# EAGLE design driver_3 (EAGLE 7.2.0)
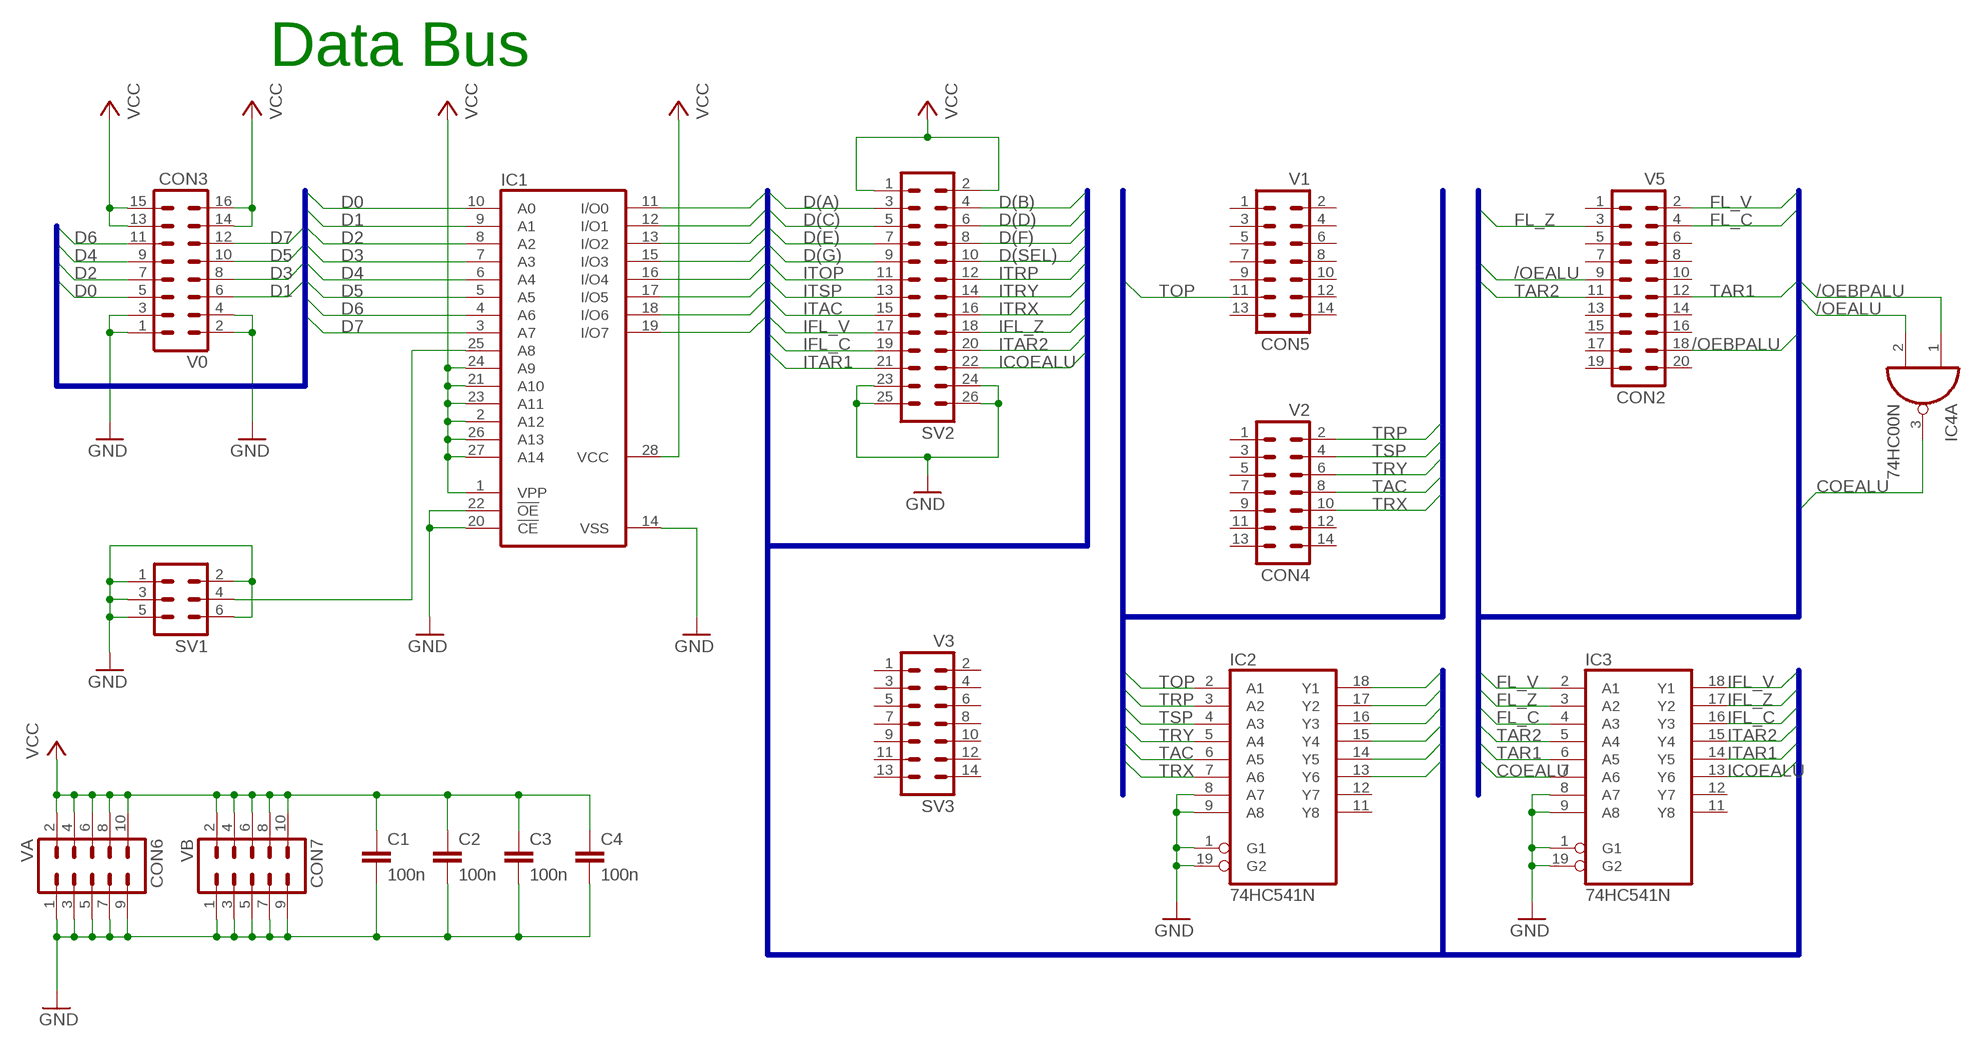
[diagram p0: schematic, sheet 1]

## Parts
C1  100n  C-EU050-024X044  [C050-024X044]
C2  100n  C-EU050-024X044  [C050-024X044]
C3  100n  C-EU050-024X044  [C050-024X044]
C4  100n  C-EU050-024X044  [C050-024X044]
CON2  V5  ML20  [ML20]
CON3  V0  ML16  [ML16]
CON4  V2  ML14  [ML14]
CON5  V1  ML14  [ML14]
CON6  VA  ML10  [ML10]
CON7  VB  ML10  [ML10]
IC1  27C256AG  [DIL28-6]
IC2  74HC541N  [DIL20]
IC3  74HC541N  [DIL20]
IC4  74HC00N  [DIL14]
SV1  ML6  [ML6]
SV2  ML26L  [ML26L]
SV3  V3  ML14  [ML14]

## Nets
/OEALU: CON2.9 IC4.2(A:I1)
/OEBPALU: CON2.18 IC4.1(A:I0)
COEALU: IC3.7(A6) IC4.3(A:O)
D0: CON3.5 IC1.10(A0)
D1: CON3.6 IC1.9(A1)
D2: CON3.7 IC1.8(A2)
D3: CON3.8 IC1.7(A3)
D4: CON3.9 IC1.6(A4)
D5: CON3.10 IC1.5(A5)
D6: CON3.11 IC1.4(A6)
D7: CON3.12 IC1.3(A7)
D(A): IC1.11(I/O0) SV2.3
D(B): IC1.12(I/O1) SV2.4
D(C): IC1.13(I/O2) SV2.5
D(D): IC1.15(I/O3) SV2.6
D(E): IC1.16(I/O4) SV2.7
D(F): IC1.17(I/O5) SV2.8
D(G): IC1.18(I/O6) SV2.9
D(SEL): IC1.19(I/O7) SV2.10
FL_C: CON2.4 IC3.4(A3)
FL_V: CON2.2 IC3.2(A1)
FL_Z: CON2.3 IC3.3(A2)
GND: C1.2 C2.2 C3.2 C4.2 CON3.1 CON3.2 CON3.3 CON3.4 CON6.1 CON6.3 CON6.5 CON6.7 CON6.9 CON7.1 CON7.3 CON7.5 CON7.7 CON7.9 IC1.14(VSS) IC1.20(!CE) IC1.22(!OE) IC2.1(G1) IC2.8(A7) IC2.9(A8) IC2.19(G2) IC3.1(G1) IC3.8(A7) IC3.9(A8) IC3.19(G2) SV1.1 SV1.2 SV1.3 SV1.5 SV1.6 SV2.23 SV2.24 SV2.25 SV2.26
ICOEALU: IC3.13(Y6) SV2.22
IFL_C: IC3.16(Y3) SV2.19
IFL_V: IC3.18(Y1) SV2.17
IFL_Z: IC3.17(Y2) SV2.18
ITAC: IC2.14(Y5) SV2.15
ITAR1: IC3.14(Y5) SV2.21
ITAR2: IC3.15(Y4) SV2.20
ITOP: IC2.18(Y1) SV2.11
ITRP: IC2.17(Y2) SV2.12
ITRX: IC2.13(Y6) SV2.16
ITRY: IC2.15(Y4) SV2.14
ITSP: IC2.16(Y3) SV2.13
N$2: IC1.25(A8) SV1.4
TAC: CON4.8 IC2.6(A5)
TAR1: CON2.12 IC3.6(A5)
TAR2: CON2.11 IC3.5(A4)
TOP: CON5.11 IC2.2(A1)
TRP: CON4.2 IC2.3(A2)
TRX: CON4.10 IC2.7(A6)
TRY: CON4.6 IC2.5(A4)
TSP: CON4.4 IC2.4(A3)
VCC: C1.1 C2.1 C3.1 C4.1 CON3.13 CON3.14 CON3.15 CON3.16 CON6.2 CON6.4 CON6.6 CON6.8 CON6.10 CON7.2 CON7.4 CON7.6 CON7.8 CON7.10 IC1.1(VPP) IC1.2(A12) IC1.21(A10) IC1.23(A11) IC1.24(A9) IC1.26(A13) IC1.27(A14) IC1.28(VCC) SV2.1 SV2.2
Unconnected: CON2.1 CON2.5 CON2.6 CON2.7 CON2.8 CON2.10 CON2.13 CON2.14 CON2.15 CON2.16 CON2.17 CON2.19 CON2.20 CON4.1 CON4.3 CON4.5 CON4.7 CON4.9 CON4.11 CON4.12 CON4.13 CON4.14 CON5.1 CON5.2 CON5.3 CON5.4 CON5.5 CON5.6 CON5.7 CON5.8 CON5.9 CON5.10 CON5.12 CON5.13 CON5.14 IC2.11(Y8) IC2.12(Y7) IC3.11(Y8) IC3.12(Y7) IC4.4(B:I0) IC4.5(B:I1) IC4.6(B:O) IC4.8(C:O) IC4.9(C:I0) IC4.10(C:I1) IC4.11(D:O) IC4.12(D:I0) IC4.13(D:I1) SV3.1 SV3.2 SV3.3 SV3.4 SV3.5 SV3.6 SV3.7 SV3.8 SV3.9 SV3.10 SV3.11 SV3.12 SV3.13 SV3.14

## Buses
D[0..7]
D(A),D(B),D(C),D(D),D(E),D(F),D(G),D(SEL),ITOP,ITRP,ITSP,ITRY,ITAC,ITRX,IFL_V,IFL_Z,IFL_C,ITAR1,ITAR2,ICOEALU
TAR1,TAR2,/OEALU,/OEBPALU,COEALU,FL_C,FL_Z,FL_V
TAC,TRX,TRY,TSP,TRP,TOP

## Notes on the sheet
- Data Bus

## Power pins joined to a net without a drawn wire
GND: IC2.10(GND) IC3.10(GND) IC4.7(P:GND)
VCC: IC2.20(VCC) IC3.20(VCC) IC4.14(P:VCC)

## Library data of the parts
C1-C4 = rcl:C-EU: CAPACITOR, European symbol
CON2 = con-ml:ML20: HARTING; OC_FARNELL: unknown; OC_NEWARK: unknown
CON3 = con-ml:ML16: HARTING; OC_FARNELL: unknown; OC_NEWARK: unknown
CON4 CON5 SV3 = con-ml:ML14: HARTING; OC_FARNELL: unknown; OC_NEWARK: unknown
CON6 CON7 = con-ml:ML10: HARTING; OC_FARNELL: unknown; OC_NEWARK: unknown
IC1 = memory-hitachi:27C256AG: MEMORY; OC_FARNELL: unknown; OC_NEWARK: unknown
IC2 IC3 = 74xx-eu:74*541: Octal BUFFER and LINE DRIVER, 3-state
IC4 = 74xx-eu:74*00: Quad 2-input NAND gate
SV1 = con-ml:ML6: HARTING; OC_FARNELL: unknown; OC_NEWARK: unknown
SV2 = con-ml:ML26L: HARTING; OC_FARNELL: unknown; OC_NEWARK: unknown

## Board
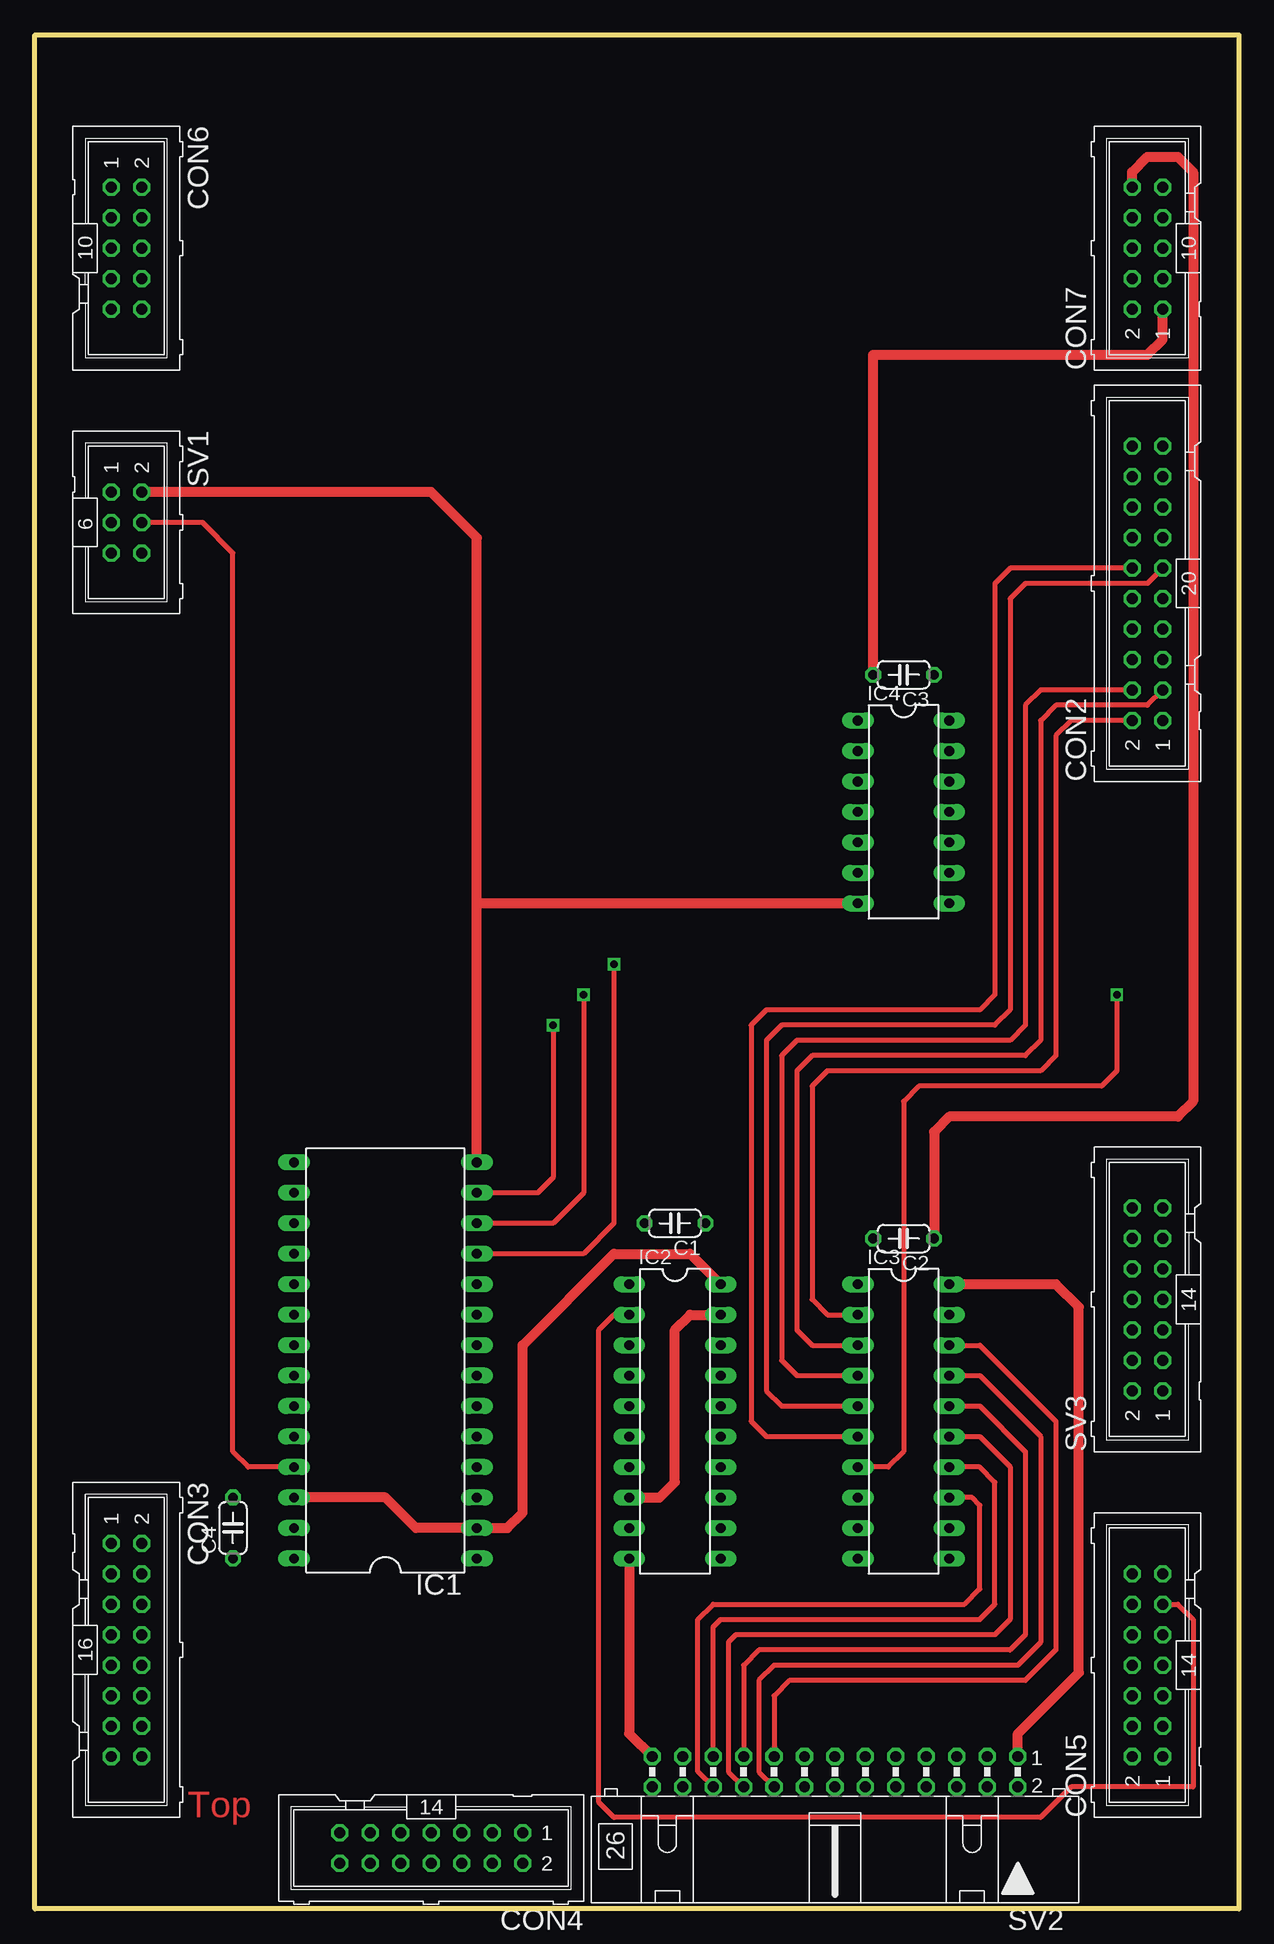
[diagram p1: board, top side]
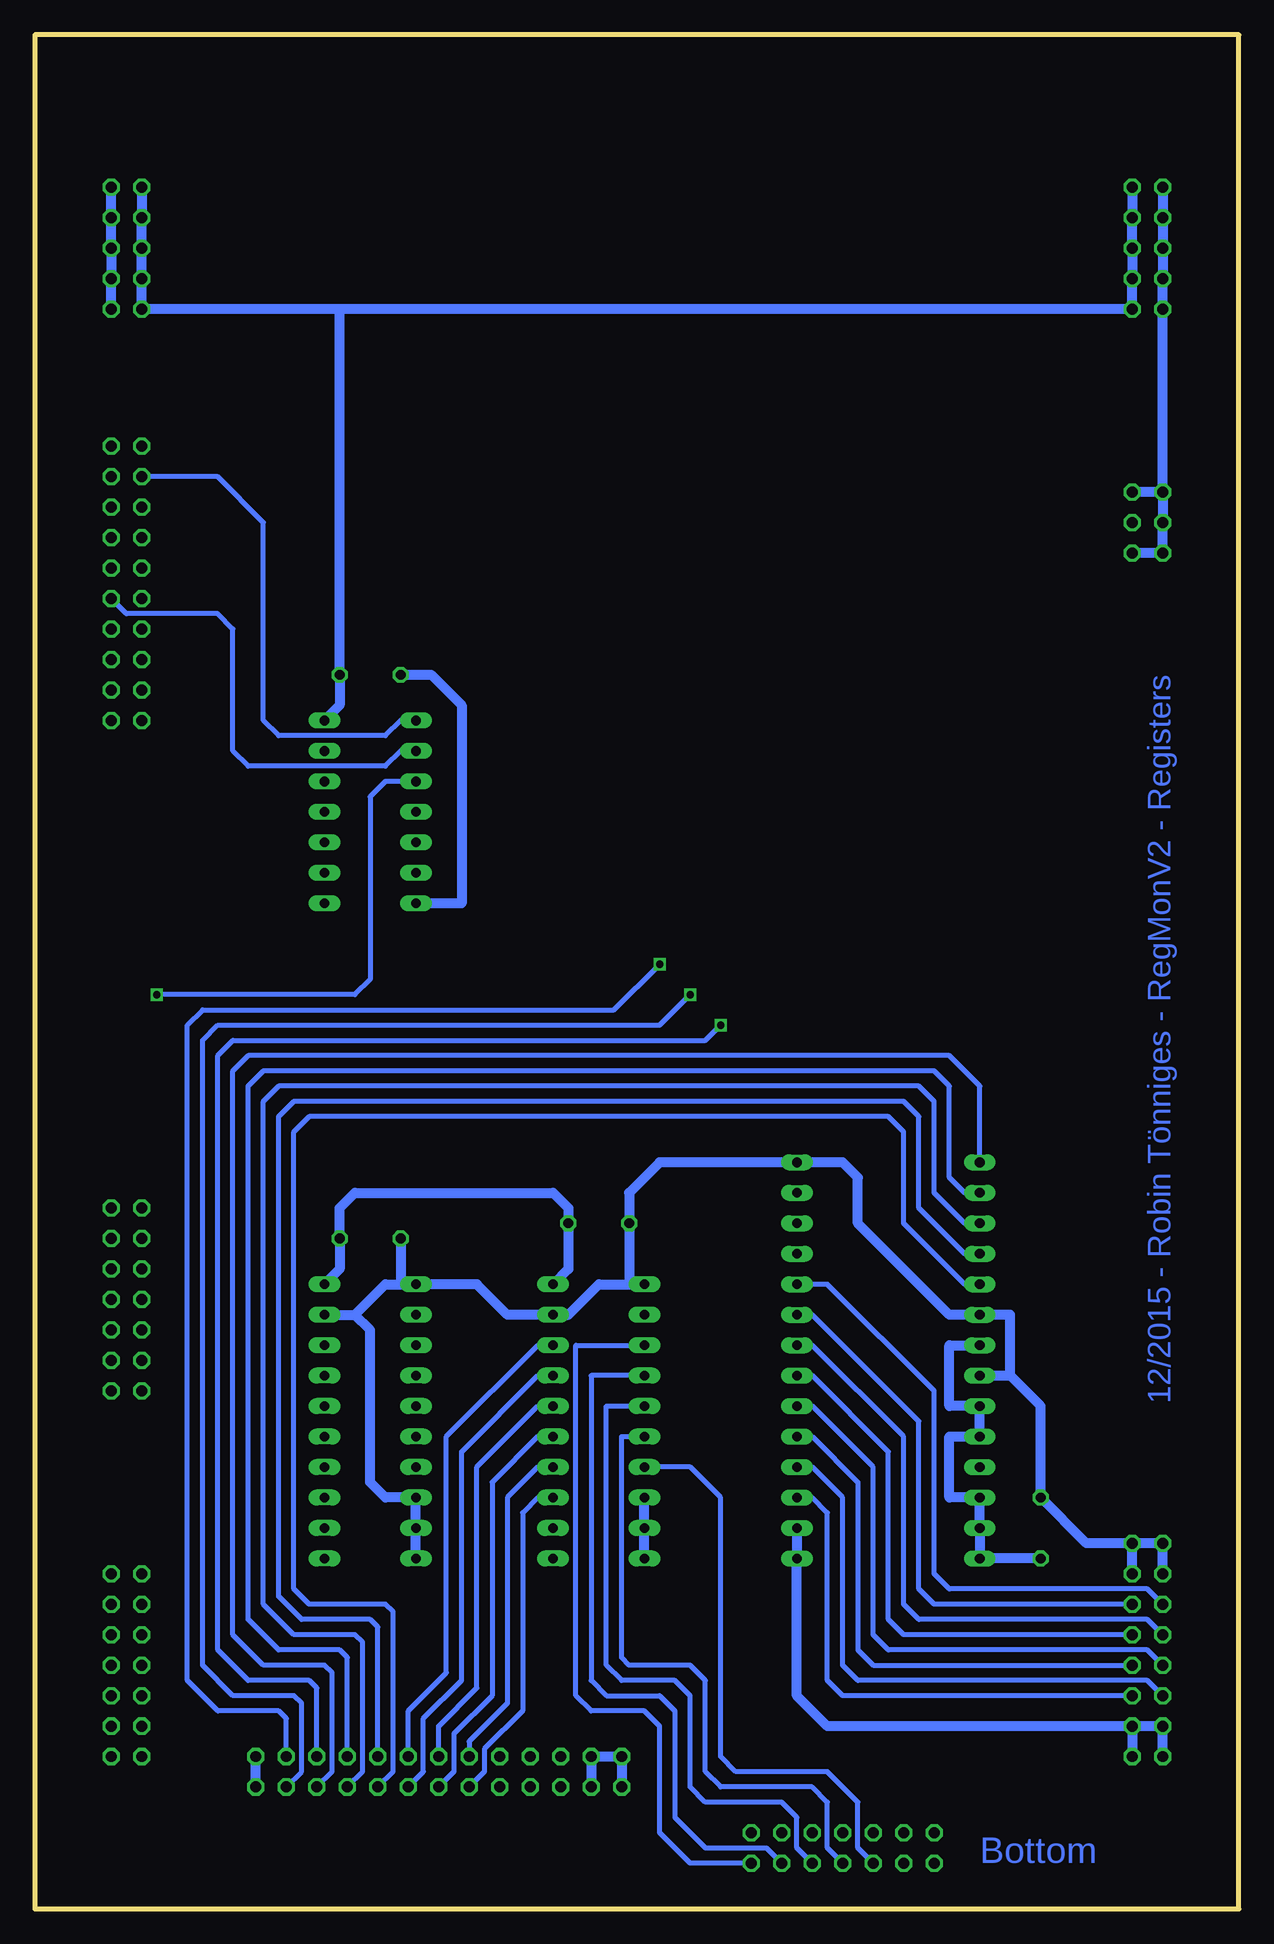
[diagram p2: board, bottom side, seen from below]

Size 100.33 x 156.21 mm. Coordinates in mm from the lower left corner, seen from the top.
Outline: 0,0 0,156.21 100.33,156.21 100.33,0 0,0
Copper layers (1*16): Top 0.035mm / dielectric 1.5mm / Bottom 0.035mm
Design rules "default": minimum track width 10mil, minimum drill 24mil, track to track 10mil, track to pad 20mil, pad to pad 8mil, via to via 8mil, smd to smd 8mil, copper to edge 40mil, drill to drill 8mil, minimum pad ring 10mil, minimum via ring 8mil, stop-mask expansion 4mil, vias tented up to drill 0mil, thermal gap 10mil

### Footprints (pad centres in the part's own frame; a part is rotated, then mirrored left to right if it is on the bottom)
C050-024X044 = drill 0.813 octagon: 1 -2.54,0; 2 2.54,0
ML20 = drill 0.914 octagon: 1 -11.43,-1.27; 2 -11.43,1.27; 3 -8.89,-1.27; 4 -8.89,1.27; 5 -6.35,-1.27; 6 -6.35,1.27; 7 -3.81,-1.27; 8 -3.81,1.27; 9 -1.27,-1.27; 10 -1.27,1.27; 11 1.27,-1.27; 12 1.27,1.27; 13 3.81,-1.27; 14 3.81,1.27; 15 6.35,-1.27; 16 6.35,1.27; 17 8.89,-1.27; 18 8.89,1.27; 19 11.43,-1.27; 20 11.43,1.27
ML16 = drill 0.914 octagon: 1 -8.89,-1.27; 2 -8.89,1.27; 3 -6.35,-1.27; 4 -6.35,1.27; 5 -3.81,-1.27; 6 -3.81,1.27; 7 -1.27,-1.27; 8 -1.27,1.27; 9 1.27,-1.27; 10 1.27,1.27; 11 3.81,-1.27; 12 3.81,1.27; 13 6.35,-1.27; 14 6.35,1.27; 15 8.89,-1.27; 16 8.89,1.27
ML14 = drill 0.914 octagon: 1 -7.62,-1.27; 2 -7.62,1.27; 3 -5.08,-1.27; 4 -5.08,1.27; 5 -2.54,-1.27; 6 -2.54,1.27; 7 0,-1.27; 8 0,1.27; 9 2.54,-1.27; 10 2.54,1.27; 11 5.08,-1.27; 12 5.08,1.27; 13 7.62,-1.27; 14 7.62,1.27
ML10 = drill 0.914 octagon: 1 -5.08,-1.27; 2 -5.08,1.27; 3 -2.54,-1.27; 4 -2.54,1.27; 5 0,-1.27; 6 0,1.27; 7 2.54,-1.27; 8 2.54,1.27; 9 5.08,-1.27; 10 5.08,1.27
DIL28-6 = drill 0.813 long: 1 -16.51,-7.62; 2 -13.97,-7.62; 3 -11.43,-7.62; 4 -8.89,-7.62; 5 -6.35,-7.62; 6 -3.81,-7.62; 7 -1.27,-7.62; 8 1.27,-7.62; 9 3.81,-7.62; 10 6.35,-7.62; 11 8.89,-7.62; 12 11.43,-7.62; 13 13.97,-7.62; 14 16.51,-7.62; 15 16.51,7.62; 16 13.97,7.62; 17 11.43,7.62; 18 8.89,7.62; 19 6.35,7.62; 20 3.81,7.62; 21 1.27,7.62; 22 -1.27,7.62; 23 -3.81,7.62; 24 -6.35,7.62; 25 -8.89,7.62; 26 -11.43,7.62; 27 -13.97,7.62; 28 -16.51,7.62
DIL20 = drill 0.813 long: 1 -11.43,-3.81; 2 -8.89,-3.81; 3 -6.35,-3.81; 4 -3.81,-3.81; 5 -1.27,-3.81; 6 1.27,-3.81; 7 3.81,-3.81; 8 6.35,-3.81; 9 8.89,-3.81; 10 11.43,-3.81; 11 11.43,3.81; 12 8.89,3.81; 13 6.35,3.81; 14 3.81,3.81; 15 1.27,3.81; 16 -1.27,3.81; 17 -3.81,3.81; 18 -6.35,3.81; 19 -8.89,3.81; 20 -11.43,3.81
DIL14 = drill 0.813 long: 1 -7.62,-3.81; 2 -5.08,-3.81; 3 -2.54,-3.81; 4 0,-3.81; 5 2.54,-3.81; 6 5.08,-3.81; 7 7.62,-3.81; 8 7.62,3.81; 9 5.08,3.81; 10 2.54,3.81; 11 0,3.81; 12 -2.54,3.81; 13 -5.08,3.81; 14 -7.62,3.81
ML6 = drill 0.914 octagon: 1 -2.54,-1.27; 2 -2.54,1.27; 3 0,-1.27; 4 0,1.27; 5 2.54,-1.27; 6 2.54,1.27
ML26L = drill 0.914 octagon: 1 -15.24,-1.27; 2 -15.24,1.27; 3 -12.7,-1.27; 4 -12.7,1.27; 5 -10.16,-1.27; 6 -10.16,1.27; 7 -7.62,-1.27; 8 -7.62,1.27; 9 -5.08,-1.27; 10 -5.08,1.27; 11 -2.54,-1.27; 12 -2.54,1.27; 13 0,-1.27; 14 0,1.27; 15 2.54,-1.27; 16 2.54,1.27; 17 5.08,-1.27; 18 5.08,1.27; 19 7.62,-1.27; 20 7.62,1.27; 21 10.16,-1.27; 22 10.16,1.27; 23 12.7,-1.27; 24 12.7,1.27; 25 15.24,-1.27; 26 15.24,1.27

### Placement (x,y rotation side)
C1  53.34,57.15 180 top
C2  72.39,55.88 180 top
C3  72.39,102.87 180 top
C4  16.51,31.75 90 top
CON2  92.71,110.49 90 top
CON3  7.62,21.59 270 top
CON4  33.02,5.08 180 top
CON5  92.71,20.32 90 top
CON6  7.62,138.43 270 top
CON7  92.71,138.43 90 top
IC1  29.21,45.72 90 top
IC2  53.34,40.64 270 top
IC3  72.39,40.64 270 top
IC4  72.39,91.44 270 top
SV1  7.62,115.57 270 top
SV2  66.67,11.43 180 top
SV3  92.71,50.8 90 top

### Tracks (layer width: path | path; a pad name or v marks a point on that pad's centre or on a via)
/OEALU
  Bottom 0.406: CON2.9 92.71,107.95 85.09,107.95 83.82,106.68 83.82,96.52 82.55,95.25 71.12,95.25 69.85,96.52 IC4.2
/OEBPALU
  Bottom 0.406: IC4.1 69.85,99.06 71.12,97.79 80.01,97.79 81.28,99.06 81.28,115.57 85.09,119.38 CON2.18
COEALU  (via drill 0.6)
  Top 0.406: v90.17,76.2 90.17,69.85 88.9,68.58 73.66,68.58 72.39,67.31 72.39,38.1 71.12,36.83 IC3.7
  Bottom 0.406: IC4.3 71.12,93.98 72.39,92.71 72.39,77.47 73.66,76.2 v90.17,76.2
D0
  Bottom 0.406: CON3.5 7.62,26.67 24.13,26.67 25.4,27.94 25.4,43.18 34.29,52.07 IC1.10
D1
  Bottom 0.406: CON3.6 25.4,25.4 26.67,26.67 26.67,40.64 35.56,49.53 IC1.9
D2
  Bottom 0.406: CON3.7 7.62,24.13 26.67,24.13 27.94,25.4 27.94,39.37 35.56,46.99 IC1.8
D3
  Bottom 0.406: CON3.8 27.94,22.86 29.21,24.13 29.21,38.1 35.56,44.45 IC1.7
D4
  Bottom 0.406: CON3.9 7.62,21.59 29.21,21.59 30.48,22.86 30.48,36.83 35.56,41.91 IC1.6
D5
  Bottom 0.406: IC1.5 35.56,39.37 31.75,35.56 31.75,21.59 30.48,20.32 CON3.10
D6
  Bottom 0.406: CON3.11 7.62,19.05 31.75,19.05 33.02,20.32 33.02,34.29 35.56,36.83 IC1.4
D7
  Bottom 0.406: CON3.12 33.02,17.78 34.29,19.05 34.29,33.02 35.56,34.29 IC1.3
D(A)  (via drill 0.6)
  Top 0.406: v48.26,78.74 48.26,57.15 45.72,54.61 IC1.11
  Bottom 0.406: SV2.3 79.38,15.88 80.01,16.51 85.09,16.51 87.63,19.05 87.63,73.66 86.36,74.93 52.07,74.93 v48.26,78.74
D(B)  (via drill 0.6)
  Top 0.406: v45.72,76.2 45.72,59.69 43.18,57.15 IC1.12
  Bottom 0.406: SV2.4 78.11,11.43 78.11,17.14 78.74,17.78 83.82,17.78 86.36,20.32 86.36,72.39 85.09,73.66 48.26,73.66 v45.72,76.2
D(C)  (via drill 0.6)
  Top 0.406: v43.18,73.66 43.18,60.96 41.91,59.69 IC1.13
  Bottom 0.406: SV2.5 76.83,18.41 77.47,19.05 82.55,19.05 85.09,21.59 85.09,71.12 83.82,72.39 44.45,72.39 v43.18,73.66
D(D)
  Bottom 0.406: IC1.15 21.59,68.58 24.13,71.12 82.55,71.12 83.82,69.85 83.82,22.86 81.28,20.32 76.2,20.32 75.56,19.68 75.56,11.43 SV2.6
D(E)
  Bottom 0.406: IC1.16 22.86,59.69 24.13,60.96 24.13,68.58 25.4,69.85 81.28,69.85 82.55,68.58 82.55,24.13 80.01,21.59 74.93,21.59 74.3,20.95 SV2.7
D(F)
  Bottom 0.406: IC1.17 22.86,57.15 25.4,59.69 25.4,67.31 26.67,68.58 80.01,68.58 81.28,67.31 81.28,25.4 78.74,22.86 73.66,22.86 73.03,22.23 73.03,11.43 SV2.8
D(G)
  Bottom 0.406: IC1.18 22.86,54.61 26.67,58.42 26.67,66.04 27.94,67.31 78.74,67.31 80.01,66.04 80.01,26.04 78.11,24.13 72.39,24.13 71.75,23.5 SV2.9
D(SEL)
  Bottom 0.406: IC1.19 22.86,52.07 27.94,57.15 27.94,64.77 29.21,66.04 77.47,66.04 78.74,64.77 78.74,26.67 77.47,25.4 71.12,25.4 70.48,24.77 70.48,11.43 SV2.10
FL_C
  Top 0.406: CON2.4 83.82,101.6 82.55,100.33 82.55,73.66 81.28,72.39 63.5,72.39 62.23,71.12 62.23,45.72 63.5,44.45 IC3.4
FL_V
  Top 0.406: CON2.2 86.36,99.06 85.09,97.79 85.09,71.12 83.82,69.85 66.04,69.85 64.77,68.58 64.77,50.8 66.04,49.53 IC3.2
FL_Z
  Top 0.406: CON2.3 92.71,100.33 85.09,100.33 83.82,99.06 83.82,72.39 82.55,71.12 64.77,71.12 63.5,69.85 63.5,48.26 64.77,46.99 IC3.3
GND
  Top 0.813: IC2.10 49.53,14.61 SV2.25 | IC1.14 36.83,83.82 | 36.83,83.82 36.83,114.3 33.02,118.11 SV1.2 | IC2.8 52.07,34.29 53.34,35.56 53.34,48.26 54.61,49.53 IC2.19 | C3.2 69.85,129.54 92.71,129.54 93.98,130.81 CON7.1 | IC4.7 36.83,83.82
  Bottom 0.813: IC2.10 IC2.9 IC2.8 | CON3.3 CON3.1 CON3.2 | CON3.4 CON3.2 | SV2.26 SV2.25 SV2.23 SV2.24 | IC1.22 19.05,44.45 | 19.05,44.45 19.05,49.53 IC1.20 24.13,49.53 31.75,57.15 31.75,60.96 33.02,62.23 IC1.14 48.26,62.23 50.8,59.69 C1.2 50.8,52.07 | CON7.1 CON7.3 CON7.5 CON7.7 CON7.9 | CON6.1 CON6.3 CON6.5 CON6.7 CON6.9 SV1.1 | SV1.1 SV1.3 SV1.5 SV1.6 | SV1.1 SV1.2 | CON3.2 12.7,30.48 C4.2 16.51,41.91 19.05,44.45 | C3.2 67.31,102.87 64.77,100.33 64.77,83.82 IC4.7 | C2.2 69.85,52.07 | IC3.19 73.66,49.53 | 73.66,49.53 71.12,52.07 69.85,52.07 | 69.85,52.07 IC3.1 63.5,52.07 60.96,49.53 IC2.19 55.88,49.53 53.34,52.07 50.8,52.07 | IC3.10 IC3.9 IC3.8 71.12,34.29 72.39,35.56 72.39,48.26 73.66,49.53 | 50.8,52.07 IC2.1
ICOEALU
  Top 0.406: SV2.22 55.24,11.43 55.24,24.13 56.52,25.4 77.47,25.4 78.74,26.67 78.74,33.66 78.11,34.29 IC3.13
IFL_C
  Top 0.406: IC3.16 78.74,41.91 82.55,38.1 82.55,22.86 81.28,21.59 60.33,21.59 59.05,20.32 SV2.19
IFL_V
  Top 0.406: IC3.18 78.74,46.99 85.09,40.64 85.09,21.59 82.55,19.05 62.87,19.05 61.59,17.78 SV2.17
IFL_Z
  Top 0.406: IC3.17 78.74,44.45 83.82,39.37 83.82,22.23 81.92,20.32 61.59,20.32 60.33,19.05 60.33,11.43 SV2.18
ITAC
  Bottom 0.406: IC2.14 58.42,36.83 60.96,34.29 60.96,17.14 64.14,13.97 SV2.15
ITAR1
  Top 0.406: SV2.21 56.52,23.5 57.15,24.13 78.74,24.13 80.01,25.4 80.01,35.56 78.74,36.83 IC3.14
ITAR2
  Top 0.406: IC3.15 78.74,39.37 81.28,36.83 81.28,24.13 80.01,22.86 58.42,22.86 57.78,22.23 57.78,11.43 SV2.20
ITOP
  Bottom 0.406: SV2.11 69.22,16.51 66.04,19.68 66.04,39.37 58.42,46.99 IC2.18
ITRP
  Bottom 0.406: SV2.12 67.94,11.43 67.94,15.88 64.77,19.05 64.77,38.1 58.42,44.45 IC2.17
ITRX
  Bottom 0.406: IC2.13 58.42,34.29 59.69,33.02 59.69,16.51 62.87,13.34 62.87,11.43 SV2.16
ITRY
  Bottom 0.406: IC2.15 58.42,39.37 62.23,35.56 62.23,17.78 65.41,14.61 65.41,11.43 SV2.14
ITSP
  Bottom 0.406: SV2.13 66.67,15.24 63.5,18.41 63.5,36.83 58.42,41.91 IC2.16
N$1
  Bottom 0.406: 0,0 0,156.21 100.33,156.21 100.33,0 0,0
N$2
  Top 0.406: IC1.25 17.78,36.83 16.51,38.1 16.51,113.03 13.97,115.57 SV1.4
TAC
  Bottom 0.406: CON4.8 34.29,5.08 34.29,8.89 35.56,10.16 43.18,10.16 44.45,11.43 44.45,19.05 45.72,20.32 50.8,20.32 51.44,20.95 51.44,39.37 IC2.6
TAR1
  Top 0.406: CON2.12 81.28,111.76 80.01,110.49 80.01,76.2 78.74,74.93 60.96,74.93 59.69,73.66 59.69,40.64 60.96,39.37 IC3.6
TAR2
  Top 0.406: CON2.11 92.71,110.49 82.55,110.49 81.28,109.22 81.28,74.93 80.01,73.66 62.23,73.66 60.96,72.39 60.96,43.18 62.23,41.91 IC3.5
TOP
  Top 0.406: CON5.11 95.25,25.4 96.52,24.13 96.52,10.16 86.36,10.16 83.82,7.62 48.26,7.62 46.99,8.89 46.99,48.26 48.26,49.53 IC2.2
TRP
  Bottom 0.406: CON4.2 45.72,3.81 48.26,6.35 48.26,15.24 49.53,16.51 53.98,16.51 55.24,17.78 55.24,46.99 IC2.3
TRX
  Bottom 0.406: CON4.10 31.75,5.08 31.75,8.89 34.29,11.43 41.91,11.43 43.18,12.7 43.18,34.29 45.72,36.83 IC2.7
TRY
  Bottom 0.406: CON4.6 36.83,5.08 36.83,7.62 38.1,8.89 44.45,8.89 45.72,10.16 45.72,17.78 46.99,19.05 51.44,19.05 52.7,20.32 52.7,41.91 IC2.5
TSP
  Bottom 0.406: IC2.4 53.98,44.45 53.98,19.05 52.7,17.78 48.26,17.78 46.99,16.51 46.99,7.62 44.45,5.08 39.37,5.08 CON4.4
VCC
  Top 0.813: SV2.1 81.92,14.61 87,19.68 87,50.16 85.09,52.07 IC3.20 | IC1.26 29.21,34.29 31.75,31.75 IC1.2 39.37,31.75 40.64,33.02 40.64,46.99 48.26,54.61 54.61,54.61 IC2.20 | CON7.10 91.44,144.78 92.71,146.05 95.25,146.05 96.52,144.78 96.52,67.31 95.25,66.04 76.2,66.04 74.93,64.77 C2.1
  Bottom 0.813: CON3.15 CON3.13 CON3.14 | CON3.14 CON3.16 | SV2.2 SV2.1 | IC1.2 IC1.1 36.83,17.78 34.29,15.24 CON3.14 | IC1.21 24.13,46.99 24.13,41.91 IC1.23 IC1.24 24.13,39.37 24.13,34.29 IC1.26 IC1.27 IC1.28 C4.1 | IC2.20 55.88,53.34 C1.1 55.88,58.42 57.15,59.69 73.66,59.69 74.93,58.42 C2.1 74.93,53.34 IC3.20 | IC4.14 74.93,100.33 C3.1 74.93,133.35 | CON7.10 CON7.8 CON7.6 CON7.4 CON7.2 74.93,133.35 | CON6.2 CON6.4 CON6.6 CON6.8 CON6.10 74.93,133.35

### Text on the board
Top: Top
Bottom: 12/2015 - Robin Tönniges - RegMonV2 - Registers | Bottom